# EAGLE schematic HX711_BrewSwitchSense_Preinfusion (EAGLE 7.6.0)
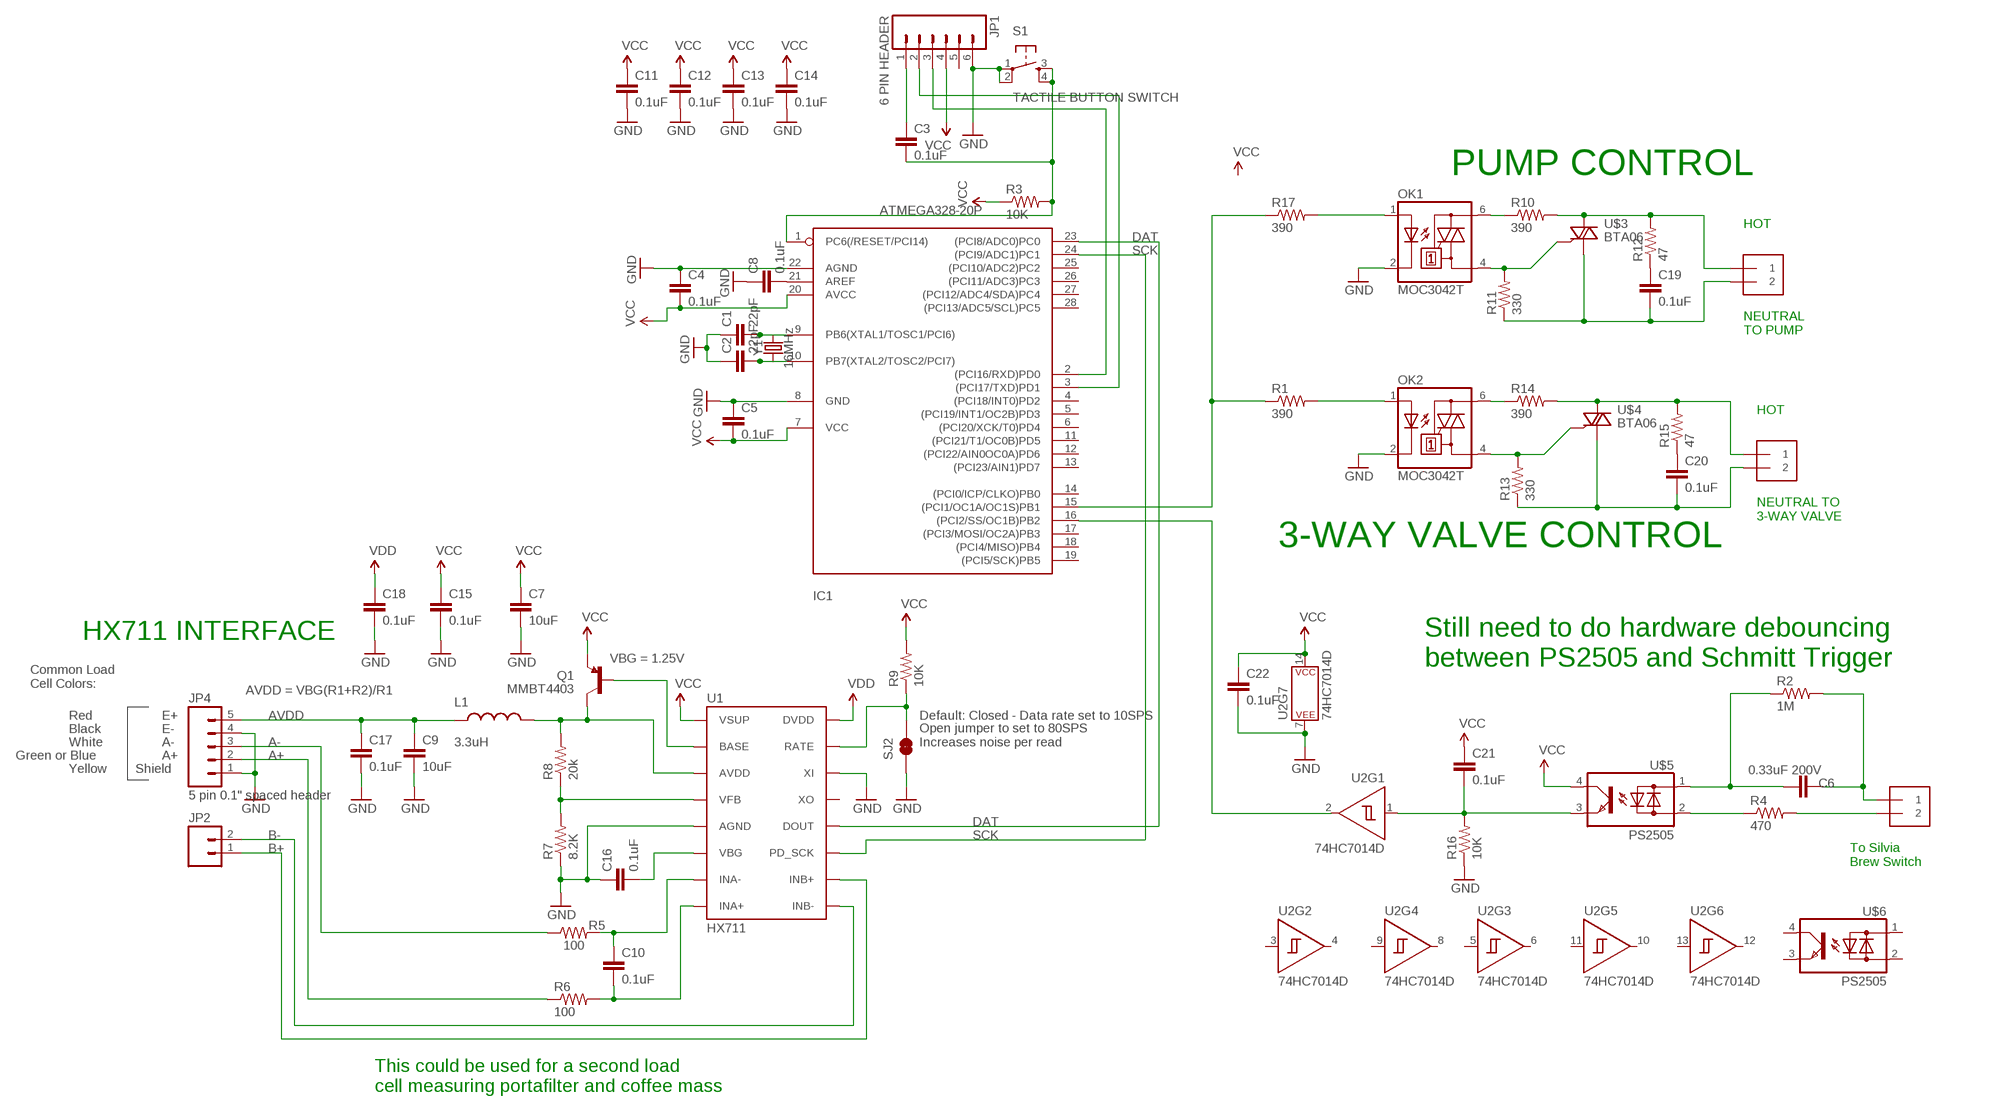
[diagram p0: schematic, sheet 1]

## Parts
C1  22pF  CAPKIT  [CAP-PTH-SMALL-KIT]
C2  22pF  CAPKIT  [CAP-PTH-SMALL-KIT]
C3  0.1uF  CAPEZ  [CAP-PTH-SMALLEZ]
C4  0.1uF  CAPEZ  [CAP-PTH-SMALLEZ]
C5  0.1uF  CAPEZ  [CAP-PTH-SMALLEZ]
C6  0.33uF 200V  C15/6  [C15B6]
C7  10uF  10UF50V20%(1210)  [1210]
C8  0.1uF  CAPEZ  [CAP-PTH-SMALLEZ]
C9  10uF  10UF50V20%(1210)  [1210]
C10  0.1uF  0.1UF-25V-5%(0603)  [0603-CAP]
C11  0.1uF  CAPEZ  [CAP-PTH-SMALLEZ]
C12  0.1uF  CAPEZ  [CAP-PTH-SMALLEZ]
C13  0.1uF  CAPEZ  [CAP-PTH-SMALLEZ]
C14  0.1uF  CAPEZ  [CAP-PTH-SMALLEZ]
C15  0.1uF  0.1UF-25V-5%(0603)  [0603-CAP]
C16  0.1uF  0.1UF-25V-5%(0603)  [0603-CAP]
C17  0.1uF  0.1UF-25V-5%(0603)  [0603-CAP]
C18  0.1uF  0.1UF-25V-5%(0603)  [0603-CAP]
C19  0.1uF  CAPEZ  [CAP-PTH-SMALLEZ]
C20  0.1uF  CAPEZ  [CAP-PTH-SMALLEZ]
C21  0.1uF  CAPEZ  [CAP-PTH-SMALLEZ]
C22  0.1uF  CAPEZ  [CAP-PTH-SMALLEZ]
IC1  ATMEGA328-20P  [DIL28-3]
J2  1X2-3.5MM  [1X2-3.5MM]
J3  1X2-3.5MM  [1X2-3.5MM]
J4  1X2-3.5MM  [1X2-3.5MM]
JP1  6 PIN HEADER  M06LOCK_LONGPADS  [1X06_LOCK_LONGPADS]
JP2  M02PTH  [1X02]
JP4  5 pin 0.1" spaced header  M05PTH  [1X05]
L1  3.3uH  INDUCTOR0805-IND  [0805]
OK1  MOC3042T  [DIL06B]
OK2  MOC3042T  [DIL06B]
Q1  MMBT4403  TRANSISTOR_PNPMMBT4403  [SOT23-3]
R1  390  RESISTORPTH-1/2W  [AXIAL-0.5]
R2  1M  RESISTORPTH-1/6W  [1/6W-RES]
R3  10K  RESISTORPTH-1/2W  [AXIAL-0.5]
R4  470  RESISTORKIT  [AXIAL-0.3-KIT]
R5  100  100OHM-1/10W-1%(0603)  [0603-RES]
R6  100  100OHM-1/10W-1%(0603)  [0603-RES]
R7  8.2K  8.2KOHM-1/10W-5%(0603)  [0603-RES]
R8  20k  20KOHM1/10W1%(0603)  [0603-RES]
R9  10K  10KOHM-1/10W-1%(0603)0603  [0603-RES]
R10  390  RESISTORPTH-1/2W  [AXIAL-0.5]
R11  330  RESISTORPTH-1/2W  [AXIAL-0.5]
R12  47  RESISTORPTH-1/2W  [AXIAL-0.5]
R13  330  RESISTORPTH-1/2W  [AXIAL-0.5]
R14  390  RESISTORPTH-1/2W  [AXIAL-0.5]
R15  47  RESISTORPTH-1/2W  [AXIAL-0.5]
R16  10K  RESISTORPTH-1/2W  [AXIAL-0.5]
R17  390  RESISTORPTH-1/2W  [AXIAL-0.5]
S1  TACTILE BUTTON SWITCH  TAC_SWITCHPTH  [TACTILE-PTH]
SJ2  JUMPER-PAD-2-NC_BY_TRACE  [PAD-JUMPER-2-NC_BY_TRACE_YES_SILK]
U1  HX711  HX711HX711  [SO16]
U2  74HC7014D  [SO14]
U$3  BTA06  [TO220V]
U$4  BTA06  [TO220V]
U$5  PS2505  [DIL04]
U$6  PS2505  [DIL04]
Y1  16MHz  CRYSTAL-16MHZPTH-HC49US  [HC49US]

## Nets
A+: JP4.2 R6.1
A-: JP4.3 R5.1
AVDD: C9.1 C17.1 JP4.5 L1.1
B+: JP2.1 U1.10(INB+)
B-: JP2.2 U1.9(INB-)
DAT: IC1.23((PCI8/ADC0)PC0) U1.12(DOUT)
GND: C1.1 C2.1 C4.1 C5.1 C7.2 C8.1 C9.2 C11.2 C12.2 C13.2 C14.2 C15.2 C16.1 C17.2 C18.2 C22.2 IC1.8(GND) IC1.22(AGND) JP1.6 JP4.1 JP4.4 OK1.2(C) OK2.2(C) R7.1 R16.P$1 S1.1 S1.2 SJ2.1 U1.5(AGND) U1.14(XI) U2.7(P$V-)
N$1: C3.1 JP1.1
N$2: OK2.1(A) R1.P$2
N$3: C3.2 IC1.1(PC6(/RESET/PCI14)) R3.P$2 S1.3 S1.4
N$4: C8.2 IC1.21(AREF)
N$5: C1.2 IC1.9(PB6(XTAL1/TOSC1/PCI6)) Y1.2
N$6: C2.2 IC1.10(PB7(XTAL2/TOSC2/PCI7)) Y1.1
N$7: C6.1 R2.1 U$5.1(AC1)
N$8: C6.2 J2.1 R2.2
N$9: IC1.3((PCI17/TXD)PD1) JP1.2
N$10: IC1.2((PCI16/RXD)PD0) JP1.3
N$11: R4.P$1 U$5.2(AC2)
N$12: J2.2 R4.P$2
N$13: Q1.1(B) U1.2(BASE)
N$14: R7.2 R8.1 U1.4(VFB)
N$15: C16.2 U1.6(VBG)
N$16: L1.2 Q1.3(C) R8.2 U1.3(AVDD)
N$17: R9.1 SJ2.2 U1.15(RATE)
N$18: C10.1 R5.2 U1.7(INA-)
N$19: C10.2 R6.2 U1.8(INA+)
N$20: IC1.15((PCI1/OC1A/OC1S)PB1) R1.P$1 R17.P$1
N$21: OK1.6(A2) R10.P$1
N$22: J3.1 R10.P$2 R12.P$2 U$3.2(A2)
N$23: OK1.4(A1) R11.P$2 U$3.3(G)
N$24: C19.2 J3.2 R11.P$1 U$3.1(A1)
N$25: C19.1 R12.P$1
N$26: C20.1 R15.P$1
N$27: OK2.6(A2) R14.P$1
N$28: J4.1 R14.P$2 R15.P$2 U$4.2(A2)
N$29: OK2.4(A1) R13.P$2 U$4.3(G)
N$30: C20.2 J4.2 R13.P$1 U$4.1(A1)
N$32: C21.2 R16.P$2 U2.1(A) U$5.3(E)
N$34: IC1.16((PCI2/SS/OC1B)PB2) U2.2(Y)
N$35: OK1.1(A) R17.P$2
SCK: IC1.24((PCI9/ADC1)PC1) U1.11(PD_SCK)
VCC: C4.2 C5.2 C7.1 C11.1 C12.1 C13.1 C14.1 C15.1 C21.1 C22.1 IC1.7(VCC) IC1.20(AVCC) JP1.4 Q1.2(E) R3.P$1 R9.2 U1.1(VSUP) U2.14(P$V+) U$5.4(C)
VDD: C18.1 U1.16(DVDD)
Unconnected: IC1.4((PCI18/INT0)PD2) IC1.5((PCI19/INT1/OC2B)PD3) IC1.6((PCI20/XCK/T0)PD4) IC1.11((PCI21/T1/OC0B)PD5) IC1.12((PCI22/AIN0OC0A)PD6) IC1.13((PCI23/AIN1)PD7) IC1.14((PCI0/ICP/CLKO)PB0) IC1.17((PCI3/MOSI/OC2A)PB3) IC1.18((PCI4/MISO)PB4) IC1.19((PCI5/SCK)PB5) IC1.25((PCI10/ADC2)PC2) IC1.26((PCI11/ADC3)PC3) IC1.27((PCI12/ADC4/SDA)PC4) IC1.28((PCI13/ADC5/SCL)PC5) JP1.5 U1.13(XO) U2.3(A) U2.4(Y) U2.5(A) U2.6(Y) U2.8(Y) U2.9(A) U2.10(Y) U2.11(A) U2.12(Y) U2.13(A) U$6.1(AC1) U$6.2(AC2) U$6.3(E) U$6.4(C)

## Notes on the sheet
- PUMP CONTROL
- HOT
- NEUTRAL
  TO PUMP
- HOT
- NEUTRAL TO
  3-WAY VALVE
- 3-WAY VALVE CONTROL
- HX711 INTERFACE
- VBG = 1.25V
- Still need to do hardware debouncing
  between PS2505 and Schmitt Trigger
- Common Load
  Cell Colors:
- AVDD = VBG(R1+R2)/R1
- Red | E+ | Default: Closed - Data rate set to 10SPS
- Black | E-
- White | A-
- Open jumper to set to 80SPS
  Increases noise per read
- Green or Blue | A+
- Yellow | Shield
- To Silvia
  Brew Switch
- This could be used for a second load
  cell measuring portafilter and coffee mass

## Library data of the parts
C1-C5 C8 C11-C14 C19-C22 = SparkFun-Capacitors:CAP: Capacitor Standard 0603 ceramic capacitor, and 0.1" leaded capacitor.
C6 = capacitor-wima:C: CAPACITOR naming: grid - package width
C7 C9 = SparkFun-Capacitors:10UF50V20%(1210): CAP-09824; PROD_ID: CAP-09824
C10 C15-C18 = SparkFun-Capacitors:0.1UF-25V-5%(0603): CAP-08604; PROD_ID: CAP-08604
IC1 = atmega328:ATMEGA328*P: MICROCONTROLLER 32 kBytes FLASH 2 kBytes SRAM 1 kBytes EEPROM USART 8-channel 10 bit ADC
J2-J4 = adafruit:1X2: 3.5mm Terminal block http://www.ladyada.net/library/pcb/eaglelibrary.html
JP1 = SparkFun-Connectors:M06: Header 6 Standard 6-pin 0.1" header. Use with straight break away headers (SKU : PRT-00116), right angle break away headers (PRT-00553), swiss pins (PRT-00743), machine pins (PRT-00117), and female headers (PRT-00115). Molex polarized connector foot print use with SKU : PRT-08094 with associated crimp pins and housings. NOTES ON THE VARIANTS LOCK and LOCK_LONGPADS... This footprint was designed to help hold the alignment of a through-hole component (i.e. 6-pin header) while soldering it into place. You may notice that each hole has been shifted either up or down by 0.005 of an inch from it's more standard position (which is a perfectly straight line). This slight alteration caused the pins (the squares in the middle) to touch the edges of the holes. Because they are alternating, it causes a "brace" to hold the component in place. 0.005 has proven to be the perfect amount of "off-center" position when using our standard breakaway headers. Although looks a little odd when you look at the bare footprint, once you have a header in there, the alteration is very hard to notice. Also, if you push a header all the way into place, it is covered up entirely on the bottom side. This idea of altering the position of holes to aid alignment will be further integrated into the Sparkfun Library for other footprints. It can help hold any component with 3 or more connection pins.
JP2 = SparkFun-Connectors:M02: Standard 2-pin 0.1" header. Use with - straight break away headers ( PRT-00116) - right angle break away headers (PRT-00553) - swiss pins (PRT-00743) - machine pins (PRT-00117) - female headers (PRT-00115) Molex polarized connector foot print use with: PRT-08233 with associated crimp pins and housings. 2.54_SCREWTERM for use with PRT-10571. 3.5mm Screw Terminal footprints for PRT-08084 5mm Screw Terminal footprints for use with PRT-08432
JP4 = SparkFun-Connectors:M05: Header 5 Standard 5-pin 0.1" header. Use with straight break away headers (SKU : PRT-00116), right angle break away headers (PRT-00553), swiss pins (PRT-00743), machine pins (PRT-00117), and female headers (PRT-00115). Molex polarized connector foot print use with SKU : PRT-08230 with associated crimp pins and housings.
L1 = SparkFun-Passives:INDUCTOR: Inductors Basic Inductor/Choke - 0603 and 1206. Footprints are not proven and vary greatly between part numbers. INDUCTOR POWER 3.3UH 4.0A SMD 0.197" L x 0.197" W x 0.177" H (5.00mm x 5.00mm x 4.50mm); PROD_ID: NDUC-13076
OK1 OK2 = optocoupler:MOC30*: 6-Pin DIP Zero-Cross Optoisolators Triac Driver Output (250/400 Volt Peak) Source: http://www.fairchildsemi.com/ds/MO/MOC3043-M.pdf; OC_FARNELL: unknown; OC_NEWARK: unknown
Q1 = SparkFun-DiscreteSemi:TRANSISTOR_PNP: Generic PNP BJT Double check pinouts against datasheets- not all devices are the same! MMBT3906 - 40V 200mA SOT-23 (TRANS-08052) MMBT4403 - 40V 600mA SOT-23 (TRANS-09245); PROD_ID: TRANS-09245
R1-R4 R10-R17 = SparkFun-Passives:RESISTOR: Resistor Basic schematic elements and footprints for 0603, 1206, and PTH resistors.
R5 R6 = SparkFun-Resistors:100OHM-1/10W-1%(0603): RES-07863; PROD_ID: RES-07863
R7 = SparkFun-Resistors:8.2KOHM-1/10W-5%(0603): RES-10646; PROD_ID: RES-10646
R8 = SparkFun-Resistors:20KOHM1/10W1%(0603): RES-09383; PROD_ID: RES-09383
R9 = SparkFun-Resistors:10KOHM-1/10W-1%(0603): RES-00824; PROD_ID: RES-00824
S1 = SparkFun-Retired:TAC_SWITCH: Momentary Switch Button commonly used for reset or general input. Spark Fun Electronics SKU : COM-00097 SMT- SWCH-08247
SJ2 = SparkFun-Passives:JUMPER-PAD-2-NC_BY_TRACE
U1 = Testing:HX711; PROD_ID: IC-12445
U2 = SparkFun-IC-Logic:74*7014: Schmitt-trigger Hex Buffer The 74HC7014 is a hex buffer with precision Schmitt-trigger inputs. The precisely defined trigger levels are lying in a window between (0.55 x VCC) and (0.65 x VCC). It makes the circuit suitable to operate in a highly noisy environment. Input shorts are allowed to -1.5 V and +16 V without disturbing other channels. Inputs include clamp diodes that enable the use of current limiting resistors to interface inputs to voltages in excess of VCC. Schmitt trigger inputs transform slowly changing input signals into sharply defined jitter-free output signals. SparkFun Products SparkFun Stepoko <https://www.sparkfun.com/products/13899> (ROB-13899); PROD_ID: IC-12527
U$3 U$4 = RossParts:BTA06
U$5 U$6 = RossParts:PS2505
Y1 = SparkFun-Clocks:CRYSTAL-16MHZ: 16MHz Crystal Digikey Example <http://www.digikey.com/product-search/en?keywords=535-9122-1-ND> Frequency: 16MHz Frequency Stability: ±50ppm Frequency Tolerance: ±20ppm Load Capacitance: 18pF SparkFun Products: Pro Micro -5V/16MHz <https://www.sparkfun.com/products/12640> SparkFun Serial Enabled LCD Kit <https://www.sparkfun.com/products/10097>; PROD_ID: XTAL-08181; SF_ID: COM-00536